# EAGLE design Sidblaster TicTac - Rev.1.3 (EAGLE 7.7.0)
CNAME: crazy-midi.de
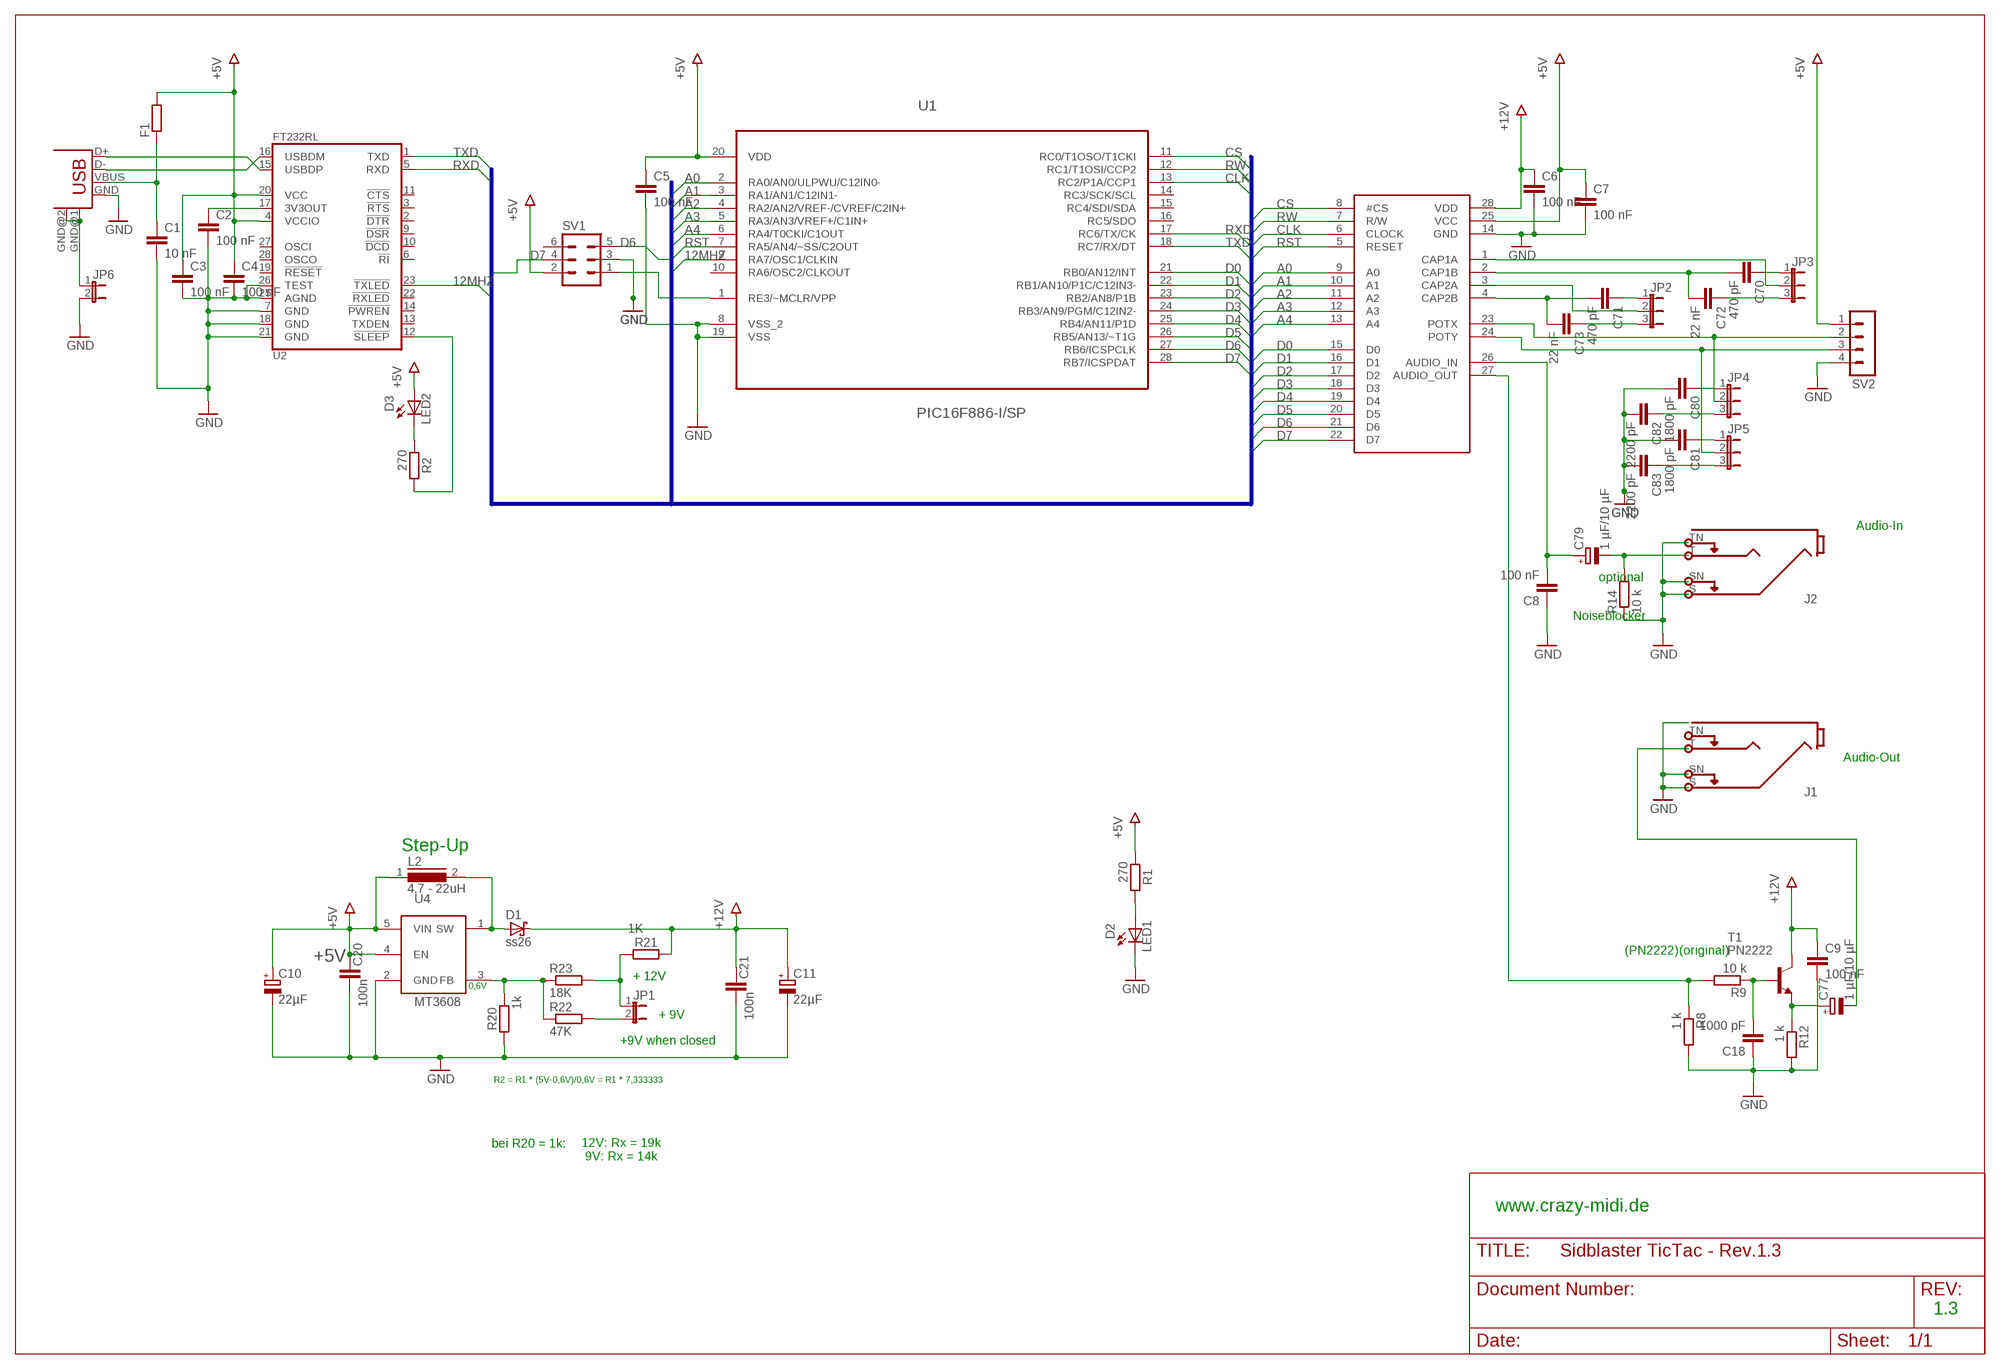
[diagram p0: schematic, sheet 1]

## Parts
C1  10 nF  C-EUC0805K  [C0805K]
C2  100 nF  C-EUC0805K  [C0805K]
C3  100 nF  C-EUC0805K  [C0805K]
C4  100 nF  C-EUC0805K  [C0805K]
C5  100 nF  C-EUC0805K  [C0805K]
C6  100 nF  C-EUC0805K  [C0805K]
C7  100 nF  C-EUC0805K  [C0805K]
C8  100 nF  C-EU025-025X050  [C025-025X050]
C9  100 nF  C-EU025-025X050  [C025-025X050]
C10  22µF  CPOL-EUE2-4  [E2-4]
C11  22µF  CPOL-EUE2-4  [E2-4]
C18  1000 pF  C-EU025-025X050  [C025-025X050]
C20  100n  C-EUC0805K  [C0805K]
C21  100n  C-EUC0805K  [C0805K]
C70  470 pF  C-EU025-025X050  [C025-025X050]
C71  470 pF  C-EU025-025X050  [C025-025X050]
C72  22 nF  C-EU025-025X050  [C025-025X050]
C73  22 nF  C-EU025-025X050  [C025-025X050]
C77  1 µF/10 µF  CPOL-EUE2.5-5  [E2,5-5]
C79  1 µF/10 µF  CPOL-EUE2.5-5  [E2,5-5]
C80  1800 pF  C-EU025-025X050  [C025-025X050]
C81  1800 pF  C-EU025-025X050  [C025-025X050]
C82  2200 pF  C-EU025-025X050  [C025-025X050]
C83  2200 pF  C-EU025-025X050  [C025-025X050]
D1  ss26  SCHOTTKY-DIODESMD  [SMB]
D2  LED1  LEDCHIPLED_1206  [CHIPLED_1206]
D3  LED2  LEDCHIPLED_1206  [CHIPLED_1206]
F1  R-EU_0207/5V  [0207/5V]
J1  MONOSW2  [NEUTRIK-NRJ4HF]
J2  MONOSW2  [NEUTRIK-NRJ4HF]
JP1  JP1E  [JP1]
JP2  JP2E  [JP2]
JP3  JP2E  [JP2]
JP4  JP2E  [JP2]
JP5  JP2E  [JP2]
JP6  JP1E  [JP1]
L2  4,7 - 22uH  1212_FPS  [FPS]
R1  270  R-EU_M0805  [M0805]
R2  270  R-EU_M0805  [M0805]
R8  1 k  R-EU_0207/10  [0207/10]
R9  10 k  R-EU_0207/10  [0207/10]
R12  1 k  R-EU_0207/10  [0207/10]
R14  10 k  R-EU_0207/10  [0207/10]
R20  1k  R-EU_M0805  [M0805]
R21  1K  R-EU_M0805  [M0805]
R22  47K  R-EU_M0805  [M0805]
R23  18K  R-EU_M0805  [M0805]
SV1  MA03-2  [MA03-2]
SV2  MA04-1  [MA04-1]
T1  PN2222  [TO92]
U1  PIC16F886-I/SP  [DIP254P762X508-28]
U2  FT232RL  [SSOP28-LD]
U3  6581  [DIL28-6]
U4  MT3608  [SOT23-6]
X1  USB-B-H  [USB-B-H]

## Nets
12MHZ: U1.9(RA7/OSC1/CLKIN) U2.23(!TXLED)
+5V: C3.1 C4.1 C5.1 C7.1 C10.+ C20.2 D3.A F1.2 L2.1 R1.2 SV1.2 SV2.1 U1.20(VDD) U2.4(VCCIO) U2.20(VCC) U3.25(VCC) U4.4(EN) U4.5(VIN)
+12V: C6.1 C9.1 C11.+ C21.2 D1.C R21.1 T1.3(C) U3.28(VDD)
A0: U1.2(RA0/AN0/ULPWU/C12IN0-) U3.9(A0)
A1: U1.3(RA1/AN1/C12IN1-) U3.10(A1)
A2: U1.4(RA2/AN2/VREF-/CVREF/C2IN+) U3.11(A2)
A3: U1.5(RA3/AN3/VREF+/C1IN+) U3.12(A3)
A4: U1.6(RA4/T0CKI/C1OUT) U3.13(A4)
C1: C2.1 U2.17(3V3OUT)
CLK: U1.13(RC2/P1A/CCP1) U3.6(CLOCK)
CS: U1.11(RC0/T1OSO/T1CKI) U3.8(#CS)
D0: U1.21(RB0/AN12/INT) U3.15(D0)
D1: U1.22(RB1/AN10/P1C/C12IN3-) U3.16(D1)
D2: U1.23(RB2/AN8/P1B) U3.17(D2)
D3: U1.24(RB3/AN9/PGM/C12IN2-) U3.18(D3)
D4: U1.25(RB4/AN11/P1D) U3.19(D4)
D5: U1.26(RB5/AN13/~T1G) U3.20(D5)
D6: SV1.5 U1.27(RB6/ICSPCLK) U3.21(D6)
D7: SV1.4 U1.28(RB7/ICSPDAT) U3.22(D7)
GND: C1.2 C2.2 C3.2 C4.2 C5.2 C6.2 C7.2 C8.1 C9.2 C10.- C11.- C18.1 C20.1 C21.1 C80.2 C81.2 C82.2 C83.2 D2.C J1.S J1.SN J2.S J2.SN J2.TN JP6.2 R8.2 R12.2 R14.1 R20.2 SV1.3 SV2.4 U1.8(VSS_2) U1.19(VSS) U2.7(GND) U2.18(GND) U2.21(GND) U2.25(AGND) U2.26(TEST) U3.14(GND) U4.2(GND) X1.GND
N$1: C8.2 C79.+ U3.26(AUDIO_IN)
N$2: U2.15(USBDP) X1.D+
N$3: C79.- J2.T R14.2
N$4: C71.1 JP2.1
N$5: R8.1 R9.2 U3.27(AUDIO_OUT)
N$6: JP1.1 R21.2 R23.2
N$7: C71.2 C73.2 U3.4(CAP2B)
N$8: C73.1 JP2.3
N$9: JP2.2 U3.3(CAP2A)
N$10: C70.2 C72.2 U3.2(CAP1B)
N$11: C70.1 JP3.1
N$12: C72.1 JP3.3
N$13: JP3.2 U3.1(CAP1A)
N$14: JP4.2 SV2.2 U3.23(POTX)
N$15: U2.16(USBDM) X1.D-
N$16: SV1.1 U1.1(RE3/~MCLR/VPP)
N$17: JP5.2 SV2.3 U3.24(POTY)
N$18: C77.- J1.T
N$19: C18.2 R9.1 T1.2(B)
N$20: C77.+ R12.1 T1.1(E)
N$21: D1.A L2.2 U4.1(SW)
N$22: JP1.2 R22.2
N$23: D2.A R1.1
N$24: D3.C R2.2
N$25: C1.1 F1.1 X1.VBUS
N$26: C80.1 JP4.1
N$27: C82.1 JP4.3
N$28: R2.1 U2.12(!SLEEP)
N$29: JP6.1 X1.GND@1(GND) X1.GND@2(GND)
N$30: C81.1 JP5.1
N$31: C83.1 JP5.3
R22: R20.1 R22.1 R23.1 U4.3(FB)
RST: U1.7(RA5/AN4/~SS/C2OUT) U3.5(RESET)
RW: U1.12(RC1/T1OSI/CCP2) U3.7(R/W)
RXD: U1.17(RC6/TX/CK) U2.5(RXD)
TXD: U1.18(RC7/RX/DT) U2.1(TXD)
Unconnected: J1.TN SV1.6 U1.10(RA6/OSC2/CLKOUT) U1.14(RC3/SCK/SCL) U1.15(RC4/SDI/SDA) U1.16(RC5/SDO) U2.2(!DTR) U2.3(!RTS) U2.6(!RI) U2.9(!DSR) U2.10(!DCD) U2.11(!CTS) U2.13(TXDEN) U2.14(!PWREN) U2.19(!RESET) U2.22(!RXLED) U2.27(OSCI) U2.28(OSCO)

## Buses
RXD,TXD,12MHZ,A[0..4],D[0..7],CS,RW,CLK,RST

## Notes on the sheet
- Audio-In
- optional
- Noiseblocker
- Audio-Out
- Step-Up
- (PN2222)(original)
- + 12V
- 0,6V
- + 9V
- +9V when closed
- R2 = R1 * (5V-0,6V)/0,6V = R1 * 7,333333
- bei R20 = 1k:
- 12V: Rx = 19k
   9V: Rx = 14k
- www.crazy-midi.de
- 1.3

## Library data of the parts
C1-C9 C18 C20 C21 C70-C73 C80-C83 = rcl:C-EU: CAPACITOR, European symbol
C10 C11 C77 C79 = rcl:CPOL-EU: POLARIZED CAPACITOR, European symbol
D1 = diode:SCHOTTKY-DIODE: Schottky Diode
D2 D3 = led:LED: LED OSRAM: - CHIPLED LG R971, LG N971, LY N971, LG Q971, LY Q971, LO R971, LY R971 LH N974, LH R974 LS Q976, LO Q976, LY Q976 LO Q996 - Hyper CHIPLED LW Q18S LB Q993, LB Q99A, LB R99A - SideLED LS A670, LO A670, LY A670, LG A670, LP A670 LB A673, LV A673, LT A673, LW A673 LH A674 LY A675 LS A676, LA A676, LO A676, LY A676, LW A676 LS A679, LY A679, LG A679 - Hyper Micro SIDELED® LS Y876, LA Y876, LO Y876, LY Y876 LT Y87S - SmartLED LW L88C, LW L88S LB L89C, LB L89S, LG L890 LS L89K, LO L89K, LY L89K LS L896, LA L896, LO L896, LY L896 - TOPLED LS T670, LO T670, LY T670, LG T670, LP T670 LSG T670, LSP T670, LSY T670, LOP T670, LYG T670 LG T671, LOG T671, LSG T671 LB T673, LV T673, LT T673, LW T673 LH T674 LS T676, LA T676, LO T676, LY T676, LB T676, LH T676, LSB T676, LW T676 LB T67C, LV T67C, LT T67C, LS T67K, LO T67K, LY T67K, LW E67C LS E67B, LA E67B, LO E67B, LY E67B, LB E67C, LV E67C, LT E67C LW T67C LS T679, LY T679, LG T679 LS T770, LO T770, LY T770, LG T770, LP T770 LB T773, LV T773, LT T773, LW T773 LH T774 LS E675, LA E675, LY E675, LS T675 LS T776, LA T776, LO T776, LY T776, LB T776 LHGB T686 LT T68C, LB T68C - Hyper Mini TOPLED® LB M676 - Mini TOPLED Santana® LG M470 LS M47K, LO M47K, LY M47K Source: http://www.osram.convergy.de LUXEON: - LUMILED® LXK2-PW12-R00, LXK2-PW12-S00, LXK2-PW14-U00, LXK2-PW14-V00 LXK2-PM12-R00, LXK2-PM12-S00, LXK2-PM14-U00 LXK2-PE12-Q00, LXK2-PE12-R00, LXK2-PE12-S00, LXK2-PE14-T00, LXK2-PE14-U00 LXK2-PB12-K00, LXK2-PB12-L00, LXK2-PB12-M00, LXK2-PB14-N00, LXK2-PB14-P00, LXK2-PB14-Q00 LXK2-PR12-L00, LXK2-PR12-M00, LXK2-PR14-Q00, LXK2-PR14-R00 LXK2-PD12-Q00, LXK2-PD12-R00, LXK2-PD12-S00 LXK2-PH12-R00, LXK2-PH12-S00 LXK2-PL12-P00, LXK2-PL12-Q00, LXK2-PL12-R00 Source: www.luxeon.com KINGBRIGHT: KA-3528ASYC Source: www.kingbright.com
F1 R1 R2 R8 R9 R12 R14 R20-R23 = rcl:R-EU_: RESISTOR, European symbol
J1 J2 = Audio Jacks 0.25 inch:MONOSW2: 1/4" mono jack, switched
JP1 JP6 = jumper:JP1E: JUMPER
JP2-JP5 = jumper:JP2E: JUMPER
L2 = my_inductors:1212_FPS
SV1 = con-lstb:MA03-2: PIN HEADER; OC_FARNELL: unknown; OC_NEWARK: unknown
SV2 = con-lstb:MA04-1: PIN HEADER; OC_FARNELL: unknown; OC_NEWARK: unknown
T1 = PN2222:PN2222: NPN Transistor Check prices <https://pricing.snapeda.com/parts/PN2222/ON%20Semiconductor/view-part?ref=eda>; AVAILABILITY: Not in stock; DESCRIPTION: Bipolar (BJT) Transistor NPN 30V 600mA 300MHz 625mW Through Hole TO-92-3; MF: ON Semiconductor; MP: PN2222; PACKAGE: TO-226-3 National Semiconductor; PRICE: None
U1 = PIC16F886-I_SP:PIC16F886-I/SP: 8-Bit CMOS Microcontrollers; AVAILABILITY: Good; DESCRIPTION: PIC16 Series 128 B RAM 3.5 kB Flash 8-Bit CMOS Microcontroller - SDIP-28; MF: Microchip; MP: PIC16F886-I/SP; PACKAGE: DIP-28 Microchip; PRICE: 2.19 USD
U2 = FT232RL:FT232RL; AVAILABILITY: Good; DESCRIPTION: Interface; USB-UART; Full Speed; SSOP28; MF: FTDI; MP: FT232RL; PACKAGE: SSOP-28 FTDI; PRICE: 4.89 USD
U3 = Mos6581_sid:6581: The Famous C64 Sound Chip - MOS6581
U4 = kwr-master-2016-08:MT3608: Boost sot23-6
X1 = con-usb-2:USB: USB Connectors

## Board
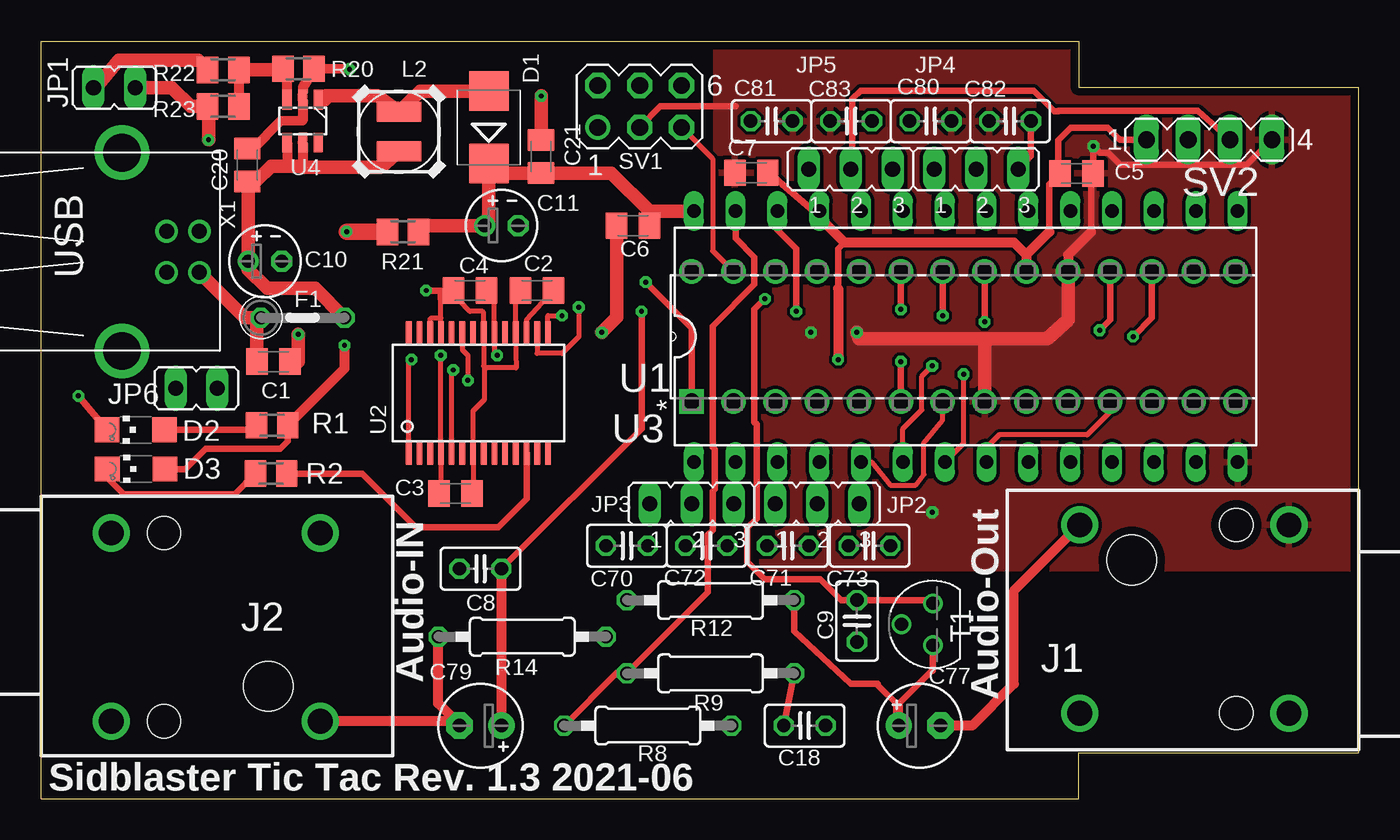
[diagram p1: board, top side]
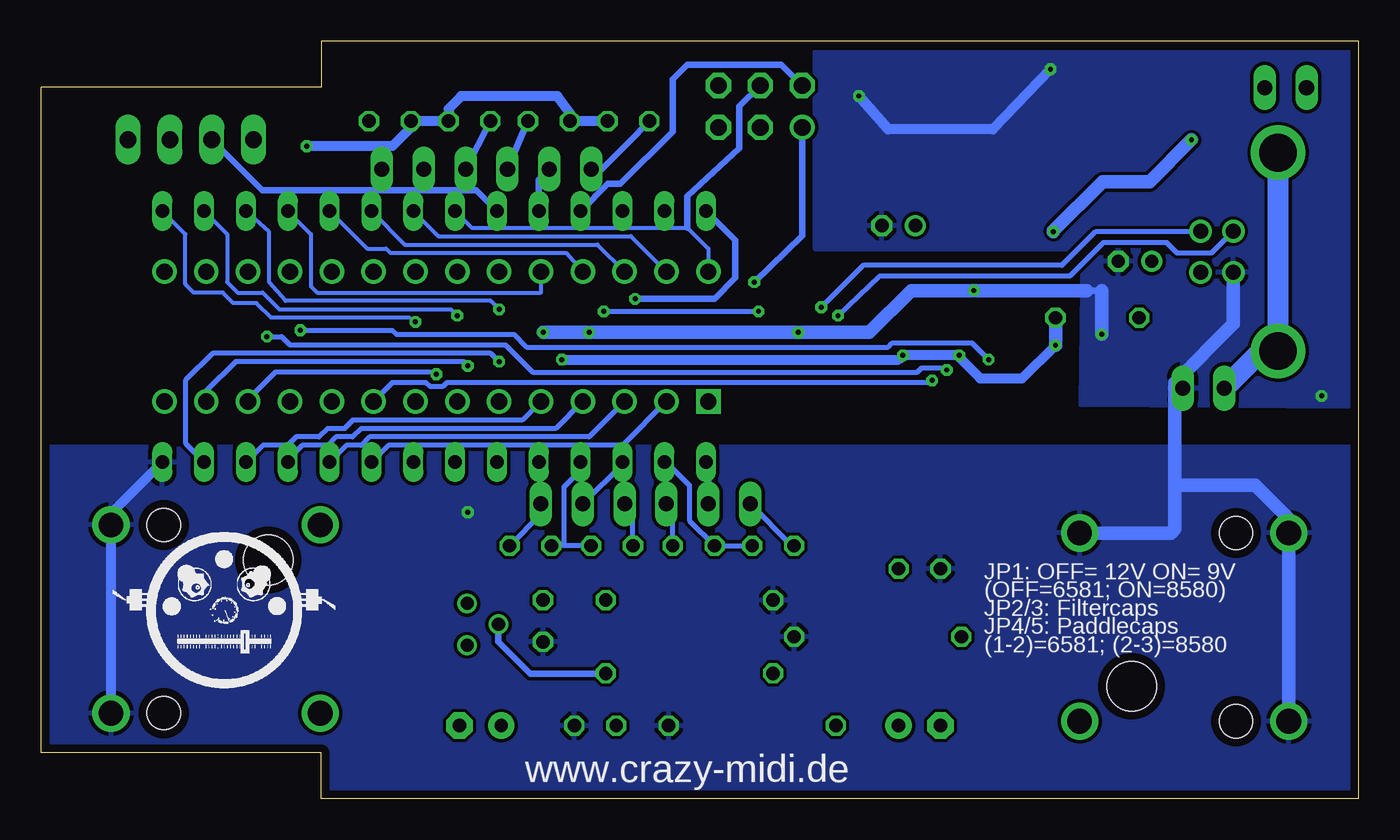
[diagram p2: board, bottom side, seen from below]

Size 80 x 46 mm. Coordinates in mm from the lower left corner, seen from the top.
Outline: 0,0 63,0 63,2.8 80,2.8 80,43.2 63,43.2 63,46 0,46 0,0
Copper layers (1*16): Top 0.035mm / dielectric 1.5mm / Bottom 0.035mm
Design rules "default *": minimum track width 10mil, minimum drill 0.3mm, track to track 8mil, track to pad 8mil, pad to pad 8mil, via to via 8mil, smd to smd 8mil, copper to edge 20mil, drill to drill 8mil, minimum pad ring 7mil, minimum via ring 8mil, stop-mask expansion 4mil, vias tented up to drill 0mil, thermal gap 10mil

### Footprints (pad centres in the part's own frame; a part is rotated, then mirrored left to right if it is on the bottom)
C0805K = smd 1.3 x 1.6: 1 -1,0; 2 1,0
C025-025X050 = drill 0.813 octagon: 1 -1.27,0; 2 1.27,0
E2-4 = drill 0.813 pad 1.27: + -1.016,0 | drill 0.813 pad 1.27 octagon: - 1.016,0
E2,5-5 = drill 0.813 pad 1.6: + -1.27,0 | drill 0.813 pad 1.6 octagon: - 1.27,0
SMB = smd 2.4 x 2.4: A 2.2,0; C -2.2,0
CHIPLED_1206 = smd 1.5 x 1.5: A 0,-1.75; C 0,1.75
0207/5V = drill 0.813 octagon: 1 -2.54,0; 2 2.54,0
NEUTRIK-NRJ4HF = drill 1.5: S 7.23,4.25; SN -4.2,4.25; T 7.23,16.95; TN -4.2,16.95 | hole 3: 5.1,13.8 | hole 2: 7.23,7.45; -4.2,7.45
JP1 = drill 0.914 long: 1 0,-1.27; 2 0,1.27
JP2 = drill 0.914 long: 1 -2.54,0; 2 0,0; 3 2.54,0
FPS = smd 1.2 x 2.7: 1 -1.2,0; 2 1.2,0
M0805 = smd 1.3 x 1.6: 1 -0.95,0; 2 0.95,0
0207/10 = drill 0.813 octagon: 1 -5.08,0; 2 5.08,0
MA03-2 = drill 1.016: 1 -2.54,-1.27 | drill 1.016 octagon: 2 -2.54,1.27; 3 0,-1.27; 4 0,1.27; 5 2.54,-1.27; 6 2.54,1.27
MA04-1 = drill 1.016 long: 1 -3.81,0; 2 -1.27,0; 3 1.27,0; 4 3.81,0
TO92 = drill 0.8: 1 -1.27,0; 2 0,1.905; 3 1.27,0
DIP254P762X508-28 = drill 0.991 square: 1 -7.874,33.02 | drill 0.991: 2 -7.874,30.48; 3 -7.874,27.94; 4 -7.874,25.4; 5 -7.874,22.86; 6 -7.874,20.32; 7 -7.874,17.78; 8 -7.874,15.24; 9 -7.874,12.7; 10 -7.874,10.16; 11 -7.874,7.62; 12 -7.874,5.08; 13 -7.874,2.54; 14 -7.874,0; 15 0,0; 16 0,2.54; 17 0,5.08; 18 0,7.62; 19 0,10.16; 20 0,12.7; 21 0,15.24; 22 0,17.78; 23 0,20.32; 24 0,22.86; 25 0,25.4; 26 0,27.94; 27 0,30.48; 28 0,33.02
SSOP28-LD = smd 0.348 x 1.397: 1 -4.225,-3.656; 2 -3.575,-3.656; 3 -2.925,-3.656; 4 -2.275,-3.656; 5 -1.625,-3.656; 6 -0.975,-3.656; 7 -0.325,-3.656; 8 0.325,-3.656; 9 0.975,-3.656; 10 1.625,-3.656; 11 2.275,-3.656; 12 2.925,-3.656; 13 3.575,-3.656; 14 4.225,-3.656; 15 4.225,3.656; 16 3.575,3.656; 17 2.925,3.656; 18 2.275,3.656; 19 1.625,3.656; 20 0.975,3.656; 21 0.325,3.656; 22 -0.325,3.656; 23 -0.975,3.656; 24 -1.625,3.656; 25 -2.275,3.656; 26 -2.925,3.656; 27 -3.575,3.656; 28 -4.225,3.656
DIL28-6 = drill 0.813 long: 1 -16.51,-7.62; 2 -13.97,-7.62; 3 -11.43,-7.62; 4 -8.89,-7.62; 5 -6.35,-7.62; 6 -3.81,-7.62; 7 -1.27,-7.62; 8 1.27,-7.62; 9 3.81,-7.62; 10 6.35,-7.62; 11 8.89,-7.62; 12 11.43,-7.62; 13 13.97,-7.62; 14 16.51,-7.62; 15 16.51,7.62; 16 13.97,7.62; 17 11.43,7.62; 18 8.89,7.62; 19 6.35,7.62; 20 3.81,7.62; 21 1.27,7.62; 22 -1.27,7.62; 23 -3.81,7.62; 24 -6.35,7.62; 25 -8.89,7.62; 26 -11.43,7.62; 27 -13.97,7.62; 28 -16.51,7.62
SOT23-6 = smd 0.55 x 1.2: 1 -0.95,-1.3; 2 0,-1.3; 3 0.95,-1.3; 4 0.95,1.3; 5 0,1.3; 6 -0.95,1.3
USB-B-H = drill 0.914: D+ 0,1.25; D- 1.981,1.25; GND 0,-1.25; VBUS 1.981,-1.25 | drill 2.286: GND@1 -2.718,6.02; GND@2 -2.718,-6.02

### Placement (x,y rotation side)
C1  14.1,26.54 0 top
C2  30.1,30.86 180 top
C3  25.15,18.54 0 top
C4  26.04,30.86 180 top
C5  62.87,37.97 0 top
C6  35.94,34.8 180 top
C7  43.11,38.01 180 top
C8  26.67,13.97 0 top
C9  49.53,10.79 270 top
C10  13.59,32.64 0 top
C11  27.94,34.8 0 top
C18  46.35,4.45 180 top
C20  12.51,38.48 270 top
C21  30.35,38.99 270 top
C70  35.56,15.37 0 top
C71  45.34,15.37 0 top
C72  40.39,15.37 180 top
C73  50.29,15.37 180 top
C77  53.34,4.45 0 top
C79  26.67,4.45 180 top
C80  54,41.14 0 top
C81  44.35,41.14 0 top
C82  58.83,41.14 180 top
C83  49.17,41.14 180 top
D1  27.18,40.77 90 top
D2  5.74,22.4 90 top
D3  5.76,20.03 90 top
F1  15.88,29.21 0 top
J1  80.01,9.4 90 top
J2  0,11.94 270 top
JP1  4.45,43.18 90 top
JP2  47.12,17.91 0 top
JP3  39.5,17.91 0 top
JP4  56.77,38.23 0 top
JP5  49.15,38.23 0 top
JP6  9.43,24.93 270 top
L2  21.72,40.51 90 top
R1  14.02,22.68 0 top
R2  13.96,19.75 180 top
R8  36.83,4.45 0 top
R9  40.64,7.62 180 top
R12  40.64,12.06 180 top
R14  29.21,9.84 180 top
R20  15.62,44.32 0 top
R21  21.97,34.42 180 top
R22  11.05,44.26 180 top
R23  11.05,42.04 180 top
SV1  36.34,42.04 0 top
SV2  70.91,40.02 0 top
T1  54.14,10.6 90 top
U1  72.52,32 90 top
U2  26.54,24.64 0 top
U3  56.13,28.07 0 top
U4  15.88,41.15 180 top
X1  7.62,33.21 0 top

### Tracks (layer width: path | path; a pad name or v marks a point on that pad's centre or on a via)
12MHZ  (via drill 0.3)
  Top 0.305: U2.23 25.57,27.26 25.91,26.92 v25.91,25.4
  Bottom 0.305: v25.91,25.4 26.04,25.27 55.37,25.27 55.63,25.02 56.39,25.02 56.64,25.27 58.67,25.27 U1.9
+5V  (via drill 0.3)
  Top 0.305: 44.43,37.86 C7.1 | 27.52,30.86 U2.20 27.52,27.09 v27.69,26.92 27.56,27.05 | 27.52,30.86 C4.1 | C3.1 24.27,18.66 U2.4 v24.27,26.91 v24.26,26.92 | 27.52,30.86 27.05,31.33
  Top 0.406: 61.21,34.42 61.21,37.32 C5.1 61.82,38.01 arc-45 61.75,38.19 61.75,40 62.5,40.75 64.75,40.75 65.41,40.09 arc45 65.58,40.02 SV2.1 | U3.25 46.91,35.68 44.96,37.34 44.43,37.86 | 48.39,30.99 48.39,33.4 48.77,33.78 | R1.2 14.97,21.72 14.5,21.25 10,21.25 8.75,20 7.54,20 D3.A
  Top 0.61: 61.21,34.42 59.82,33.02 | 59.82,33.02 U1.20 | U3.25 47.24,35.31 48.77,33.78 59.05,33.78 59.82,33.02 | U4.5 15.88,38.35 15.81,38.42 | 48.39,30.99 v48.39,26.67 | 12.57,37.42 C20.2 13.03,37.48 | U4.4 14.93,38.42 14.92,38.42 | v18.41,27.53 18.41,26.12 R1.2
  Top 0.813: 15.88,38.35 20.62,38.35 L2.1 | F1.2 16.64,30.99 13.72,30.99 12.57,32.13 C10.+ 12.57,37.42 | 13.03,37.48 13.97,38.42 14.92,38.42 15.81,38.42
  Bottom 0.305: v24.26,26.92 24.26,26.8
  Bottom 0.406: SV1.2 35.07,44.58 40.77,44.58 41.66,43.68 41.66,40.51 44.83,37.34 45.59,37.34 U3.25
  Bottom 0.61: v24.26,26.92 v27.69,26.92 27.94,26.67 v48.39,26.67 | 24.26,26.8 22.99,25.53 20.45,25.53 v18.41,27.53
  Bottom 0.813: v18.41,27.53 F1.2
+12V  (via drill 0.3)
  Top 0.305: 23.3,34.8 R21.1 | D1.C 27.18,38.61
  Top 0.406: 27.18,38.61 28.19,37.97 | v43.94,30.35 43.31,29.72 43.31,22.86 43.43,22.73 43.43,17.02 42.88,16.46 42.88,14.4 43.94,13.34 47.31,13.34 48.58,12.06 C9.1 53.94,12.06 T1.3
  Top 0.61: 36.94,35.67 36.94,35.43 C6.1
  Top 0.813: D1.C 27.18,35.05 C11.+ 23.3,34.8 | 28.19,37.97 29.32,37.97 C21.2 34.62,37.99 36.94,35.67 | U3.28 37.2,35.69 36.94,35.43
  Bottom 0.406: v43.94,30.35 39.12,30.35 37.85,31.62 37.85,33.91 U3.28
A0
  Bottom 0.305: U1.2 44.7,21.46 58.93,21.46 U3.9
A1
  Bottom 0.305: U1.3 46.74,21.97 60.07,21.97 60.58,21.46 61.47,21.46 U3.10
A2
  Bottom 0.305: U1.4 48.77,22.48 60.58,22.48 61.09,21.97 62.1,21.97 62.61,21.46 64.14,21.46 65.02,20.57 U3.11
A3
  Bottom 0.305: U1.5 50.8,22.99 61.09,22.99 61.59,22.48 62.61,22.48 63.12,21.97 64.52,21.97 65.02,21.46 66.55,21.46 U3.12
A4  (via drill 0.3)
  Top 0.406: U1.6 v52.2,26.54
  Bottom 0.305: U3.13 71.25,21.59 71.25,25.4 69.6,27.05 52.7,27.05 v52.2,26.54
C1
  Top 0.305: U2.17 29.47,29.08 C2.1
CLK  (via drill 0.3)
  Top 0.305: U3.6 52.32,22.48 53.47,23.62 53.47,25.65 v54.1,26.29
  Bottom 0.305: v54.1,26.29 54.36,26.54 68.2,26.54 69.98,24.77 U1.13
CS
  Top 0.305: U3.8 57.4,21.34 58.17,22.1 63.5,22.1 64.9,23.5 U1.11
D0  (via drill 0.3)
  Top 0.406: U1.21 v57.28,28.96
  Bottom 0.254: v57.28,28.96 57.66,29.21 66.04,29.21 66.93,30.1 68.33,30.1 68.96,30.73 70.74,30.73 71.25,31.24 71.25,34.29 U3.15
D1  (via drill 0.3)
  Top 0.406: v54.74,29.34 U1.22
  Bottom 0.254: U3.16 68.71,34.29 68.71,31.37 68.07,30.73 66.55,30.73 65.53,29.72 55.12,29.72 v54.74,29.34
D2  (via drill 0.3)
  Top 0.406: U1.23 v52.2,29.72
  Bottom 0.254: v52.2,29.72 52.7,30.23 65.15,30.23 66.17,31.37 66.17,34.42 U3.17
D3
  Bottom 0.254: U3.18 63.63,34.29 63.63,31.11 63.25,30.73 49.66,30.73 U1.24
D4
  Bottom 0.254: U3.19 60.2,33.4 59.05,33.4 58.8,33.15 48.13,33.15 U1.25
D5
  Bottom 0.254: U3.20 57.91,33.66 46.23,33.66 U1.26
D6
  Top 0.305: U1.27 40.77,33.27 40.77,38.86 SV1.5
  Bottom 0.254: U3.21 55.88,34.16 44.2,34.16 U1.27
D7
  Bottom 0.254: U3.22 53.85,34.67 40.77,34.67 39.5,33.4 U1.28
  Bottom 0.406: 40.77,34.67 40.77,36.58 37.61,39.5 37.61,42.04 SV1.4
GND  (via drill 0.3)
  Top 0.305: C2.2 28.82,30.58 U2.18 28.82,27.06 28.83,26.16 27.05,26.16 | 27.05,26.16 26.87,26.29 U2.21 26.87,29.52 26.8,29.59 26.04,29.59 25.4,30.23 25.4,30.5 C4.2 24.27,30.35 24.27,29.2 | 27.05,26.16 26.92,26.16 26.92,24.26 26.22,23.55 U2.7 26.22,18.61 C3.2 | U2.25 24.27,29.2 | U2.26 23.62,29.12 23.7,29.2 24.27,29.2
  Top 0.406: 63.75,34.42 63.75,37.83 63.87,37.94 C5.2 63.88,37.99 v63.88,39.62 64.29,39.21 64.79,39.21 65.5,38.5 73.2,38.5 SV2.4 74.72,39.32 74.61,39.21 | 24.27,30.35 24.27,30.86 v23.37,30.86 | C1.2 15.62,26.54 | SV1.3 37.59,42.04 42.16,42.04 | v2.26,24.46 D2.C
  Top 0.61: 63.75,34.42 62.36,33.02 U1.19 | v18.72,44.3 R20.2 15.9,43.2 U4.2 15.88,41.17 14.53,41.15 12.86,39.48 C20.1
  Top 0.813: U1.19 62.36,29.08 61.09,27.94 57.28,27.94 | C21.1 v30.35,42.67 | 57.28,27.94 49.66,27.94 v49.53,28.32 | U1.8 57.28,27.94 | 15.62,26.54 v15.62,28.19 | C6.2 34.94,29.23 v34.04,28.32
  Bottom 0.406: 15.62,30.86 16.51,30.86 | J2.S 4.45,4.71 4.45,4.83 4.09,4.83 4.09,4.75 4.25,4.75
  Bottom 0.61: C81.2 C83.2 47.9,41.65 48.66,42.66 54.5,42.66 55.24,41.91 55.27,41.89 C80.2 C82.2 57.53,40.77 58.67,39.62 v63.88,39.62 | v18.72,44.3 22.23,40.64 28.57,40.64 v30.35,42.67 | J1.SN J1.S 75.76,17.33 U3.14 | J2.SN 4.25,16.24 | 10.9,19.05 11.18,18.77
  Bottom 0.813: v49.53,28.32 v34.04,28.32 29.72,28.32 27.18,30.86 v23.37,30.86 16.51,30.86 | v15.62,28.19 15.62,30.86 | X1.GND 7.62,28.83 11.18,25.27 11.18,18.77 11.18,16.38 11.43,16.13 17.44,16.13 J2.TN | 4.25,4.75 J2.SN | 4.25,16.24 4.25,17 6.3,19.05 10.9,19.05
  other vias: 54.1,17.4 46.74,28.32
  pour Bottom: 33.02,45.34 33.02,33.4 16.76,33.4 16.89,23.95 0.2,23.83 0.25,45.34
  pour Bottom: 79.55,21.34 79.55,3 65.75,3 62.4,3 62.5,0.35 0.25,0.25 0,21.34
  pour Top: 41,45.5 41,14 79.5,14 79.5,42.5 62.75,42.5 62.75,45.5
N$1  (via drill 0.3)
  Top 0.406: U3.26 44.7,34.54 45.85,33.4 v45.85,29.59 | v36.45,29.59 36.45,22.48 C8.2
  Top 0.61: C8.2 27.94,5.71 C79.+
  Bottom 0.305: v45.85,29.59 v36.45,29.59
N$2  (via drill 0.3)
  Top 0.305: U2.15 30.77,29.34 v31.62,29.34
  Bottom 0.305: v31.62,29.34 29.08,31.75 17.53,31.75 15.49,33.78 11.68,33.78 11.05,33.15 8.93,33.15 X1.D+
N$3
  Top 0.406: 25.4,4.5 C79.- 24.95,4.45 24.7,4.7 | 24.1,9.81 R14.2 | J2.T
  Top 0.61: 25.4,4.5 24.1,5.8 24.1,9.81 | 24.7,4.7 J2.T
N$4
  Bottom 0.305: C71.1 44.07,17.4 JP2.1
N$5
  Top 0.406: U3.27 42.16,34.04 43.31,32.89 43.31,31.24 40.77,28.7 40.77,21.34 40.89,21.21 40.89,18.8 40.77,18.67 40.77,16.32 40.48,16.03 40.48,12.54 R9.2 34.92,7.62 R8.1
N$6  (via drill 0.3)
  Top 0.406: 18.54,34.42 v18.54,34.44 | 10.08,42.66 R23.2 | 5.77,43.13 JP1.1
  Top 0.61: 10.16,41.98 R23.2
  Top 0.813: v10.16,40.01 10.16,41.98 | R23.2 9.08,42.04 7.94,43.18 JP1.1
  Top 1.016: R21.2 18.54,34.42
  Bottom 0.813: v10.16,40.01 12.7,37.47 15.56,37.47 18.54,34.48 v18.54,34.44
N$7
  Bottom 0.305: U3.4 47.24,19.94 48.26,18.92 48.26,15.49 | 48.26,15.49 48.26,15.37 C73.2 | C71.2 48.13,15.37 48.26,15.49
N$8
  Bottom 0.305: JP2.3 49.66,17.27 C73.1
N$9
  Bottom 0.305: U3.3 44.7,20.32 JP2.2
N$10
  Bottom 0.305: C70.2 C72.2 40.64,16.89 40.64,19.05 42.04,20.45 U3.2
N$11
  Bottom 0.305: C70.1 34.42,15.37 JP3.1
N$12
  Bottom 0.305: C72.1 41.66,17.53 JP3.3
N$13
  Bottom 0.406: U3.1 39.5,20.32 JP3.2
N$14
  Bottom 0.406: U3.23 53.59,36.96 56.77,36.96 | JP4.2 56.77,36.96 | 56.77,36.96 66.58,36.96 SV2.2
N$15  (via drill 0.3)
  Top 0.305: v32.64,29.84 32.64,28.07 31.62,27.05 30.12,27.05 U2.16
  Bottom 0.305: X1.D- 9.77,34.42 16,34.42 18.03,32.38 30.1,32.38 v32.64,29.84
N$16  (via drill 0.3)
  Top 0.406: v36.7,31.37 39.5,28.57 U1.1
  Bottom 0.406: SV1.1 33.8,34.17 v36.7,31.37
N$17
  Top 0.406: SV2.3 70.23,41.77 61.77,41.77 61.75,41.75 61.5,41.75 60.25,43 49.75,43 49.25,42.5 49.25,38.33 JP5.2
  Bottom 0.406: U3.24 49.78,37.59 JP5.2
N$18
  Top 0.61: J1.T 59.05,12.62 59.05,6.99 56.52,4.45 C77.-
N$19
  Top 0.406: C18.2 R9.1
  Bottom 0.406: T1.2 52.23,9.54 50.3,7.6 45.74,7.6 R9.1
N$20
  Top 0.406: R12.1 45.72,10.16 49.15,6.99 50.8,6.99 50.8,6.9 52,5.7 54.09,7.79 54.14,7.79 T1.1 | 52,4.51 C77.+
  Top 0.61: 52,5.7 52,4.51
N$21
  Top 0.406: U4.1 17.22,42.45
  Top 0.813: 17.22,42.45 17.27,42.5 17.27,42.67 20.45,42.67 L2.2 23.02,42.97 D1.A
N$22
  Top 0.406: JP1.2 3.3,43.18 | 10.12,44.83 R22.2
  Top 0.61: 9.53,44.83 R22.2
  Top 0.813: 3.3,43.18 4.72,44.83 9.53,44.83
N$23
  Top 0.406: R1.1 12.75,22.5 arc-90 12.65,22.4 D2.A
N$24
  Top 0.406: D3.C 4.01,19.49 5,18.5 11.76,18.5 R2.2
N$25
  Top 0.406: 13.1,29.21 F1.1
  Top 0.813: C1.1 13.1,29.21 | X1.VBUS 12.35,29.21 F1.1
N$26
  Bottom 0.406: JP4.1 C80.1
N$27
  Top 0.406: JP4.3 60.09,39.01 C82.1
N$28
  Top 0.406: U2.12 29.47,18.22 27.75,16.5 22.75,16.5 19.5,19.75 R2.1
N$29
  Bottom 1.27: JP6.1 5.9,27.19 X1.GND@2 X1.GND@1
N$30
  Bottom 0.406: C81.1 44.32,39.88 45.97,38.23 JP5.1
N$31
  Bottom 0.406: C83.1 JP5.3
R22
  Top 0.305: 14.93,44.07 R20.1
  Top 0.61: U4.3 14.93,44.07 | 14.61,44.26 R20.1 | R22.1 R23.1
  Top 0.813: R22.1 14.61,44.26
RST
  Top 0.305: U3.5 50.42,20.45 51.56,19.05 53.09,19.05 53.59,19.68 53.59,21.59 54.74,22.99 U1.7
RW  (via drill 0.3)
  Top 0.305: U3.7 56.01,21.59 v56.01,25.78
  Bottom 0.305: v56.01,25.78 56.39,25.91 65.79,25.91 67.44,24.26 U1.12
RXD  (via drill 0.3)
  Top 0.305: U2.5 24.92,25.91 v25.02,26.04
  Top 0.406: U1.17 67.44,29.21 v66.29,28.07
  Bottom 0.305: v66.29,28.07 65.41,28.07 64.9,27.56 51.82,27.56 50.16,25.91 26.8,25.91 26.54,26.16 25.27,26.16 v25.02,26.04
TXD  (via drill 0.3)
  Top 0.305: U2.1 22.32,26.54 v22.48,26.67
  Top 0.406: U1.18 64.9,29.08 v64.26,28.45
  Bottom 0.305: v64.26,28.45 58.67,28.45 58.42,28.19 51.31,28.19 50.55,27.43 28.57,27.43 28.32,27.69 23.5,27.69 v22.48,26.67

### Text on the board
tPlace: Audio-IN | Audio-Out | Sidblaster Tic Tac Rev. 1.3 2021-06
bPlace: JP1: OFF= 12V ON= 9V / (OFF=6581; ON=8580) / JP2/3: Filtercaps / JP4/5: Paddlecaps / (1-2)=6581; (2-3)=8580 | www.crazy-midi.de
tNames: USB